# EasyEDA schematic TASHIMASU_MAINBOARD_2020-07-29_17-58-20.json
TITLE: Sheet_1; REV: 1.0; Date: 2019-01-28; Sheet: 1/1; Drawn By: ahmetakifkaya11; Company: Your Company
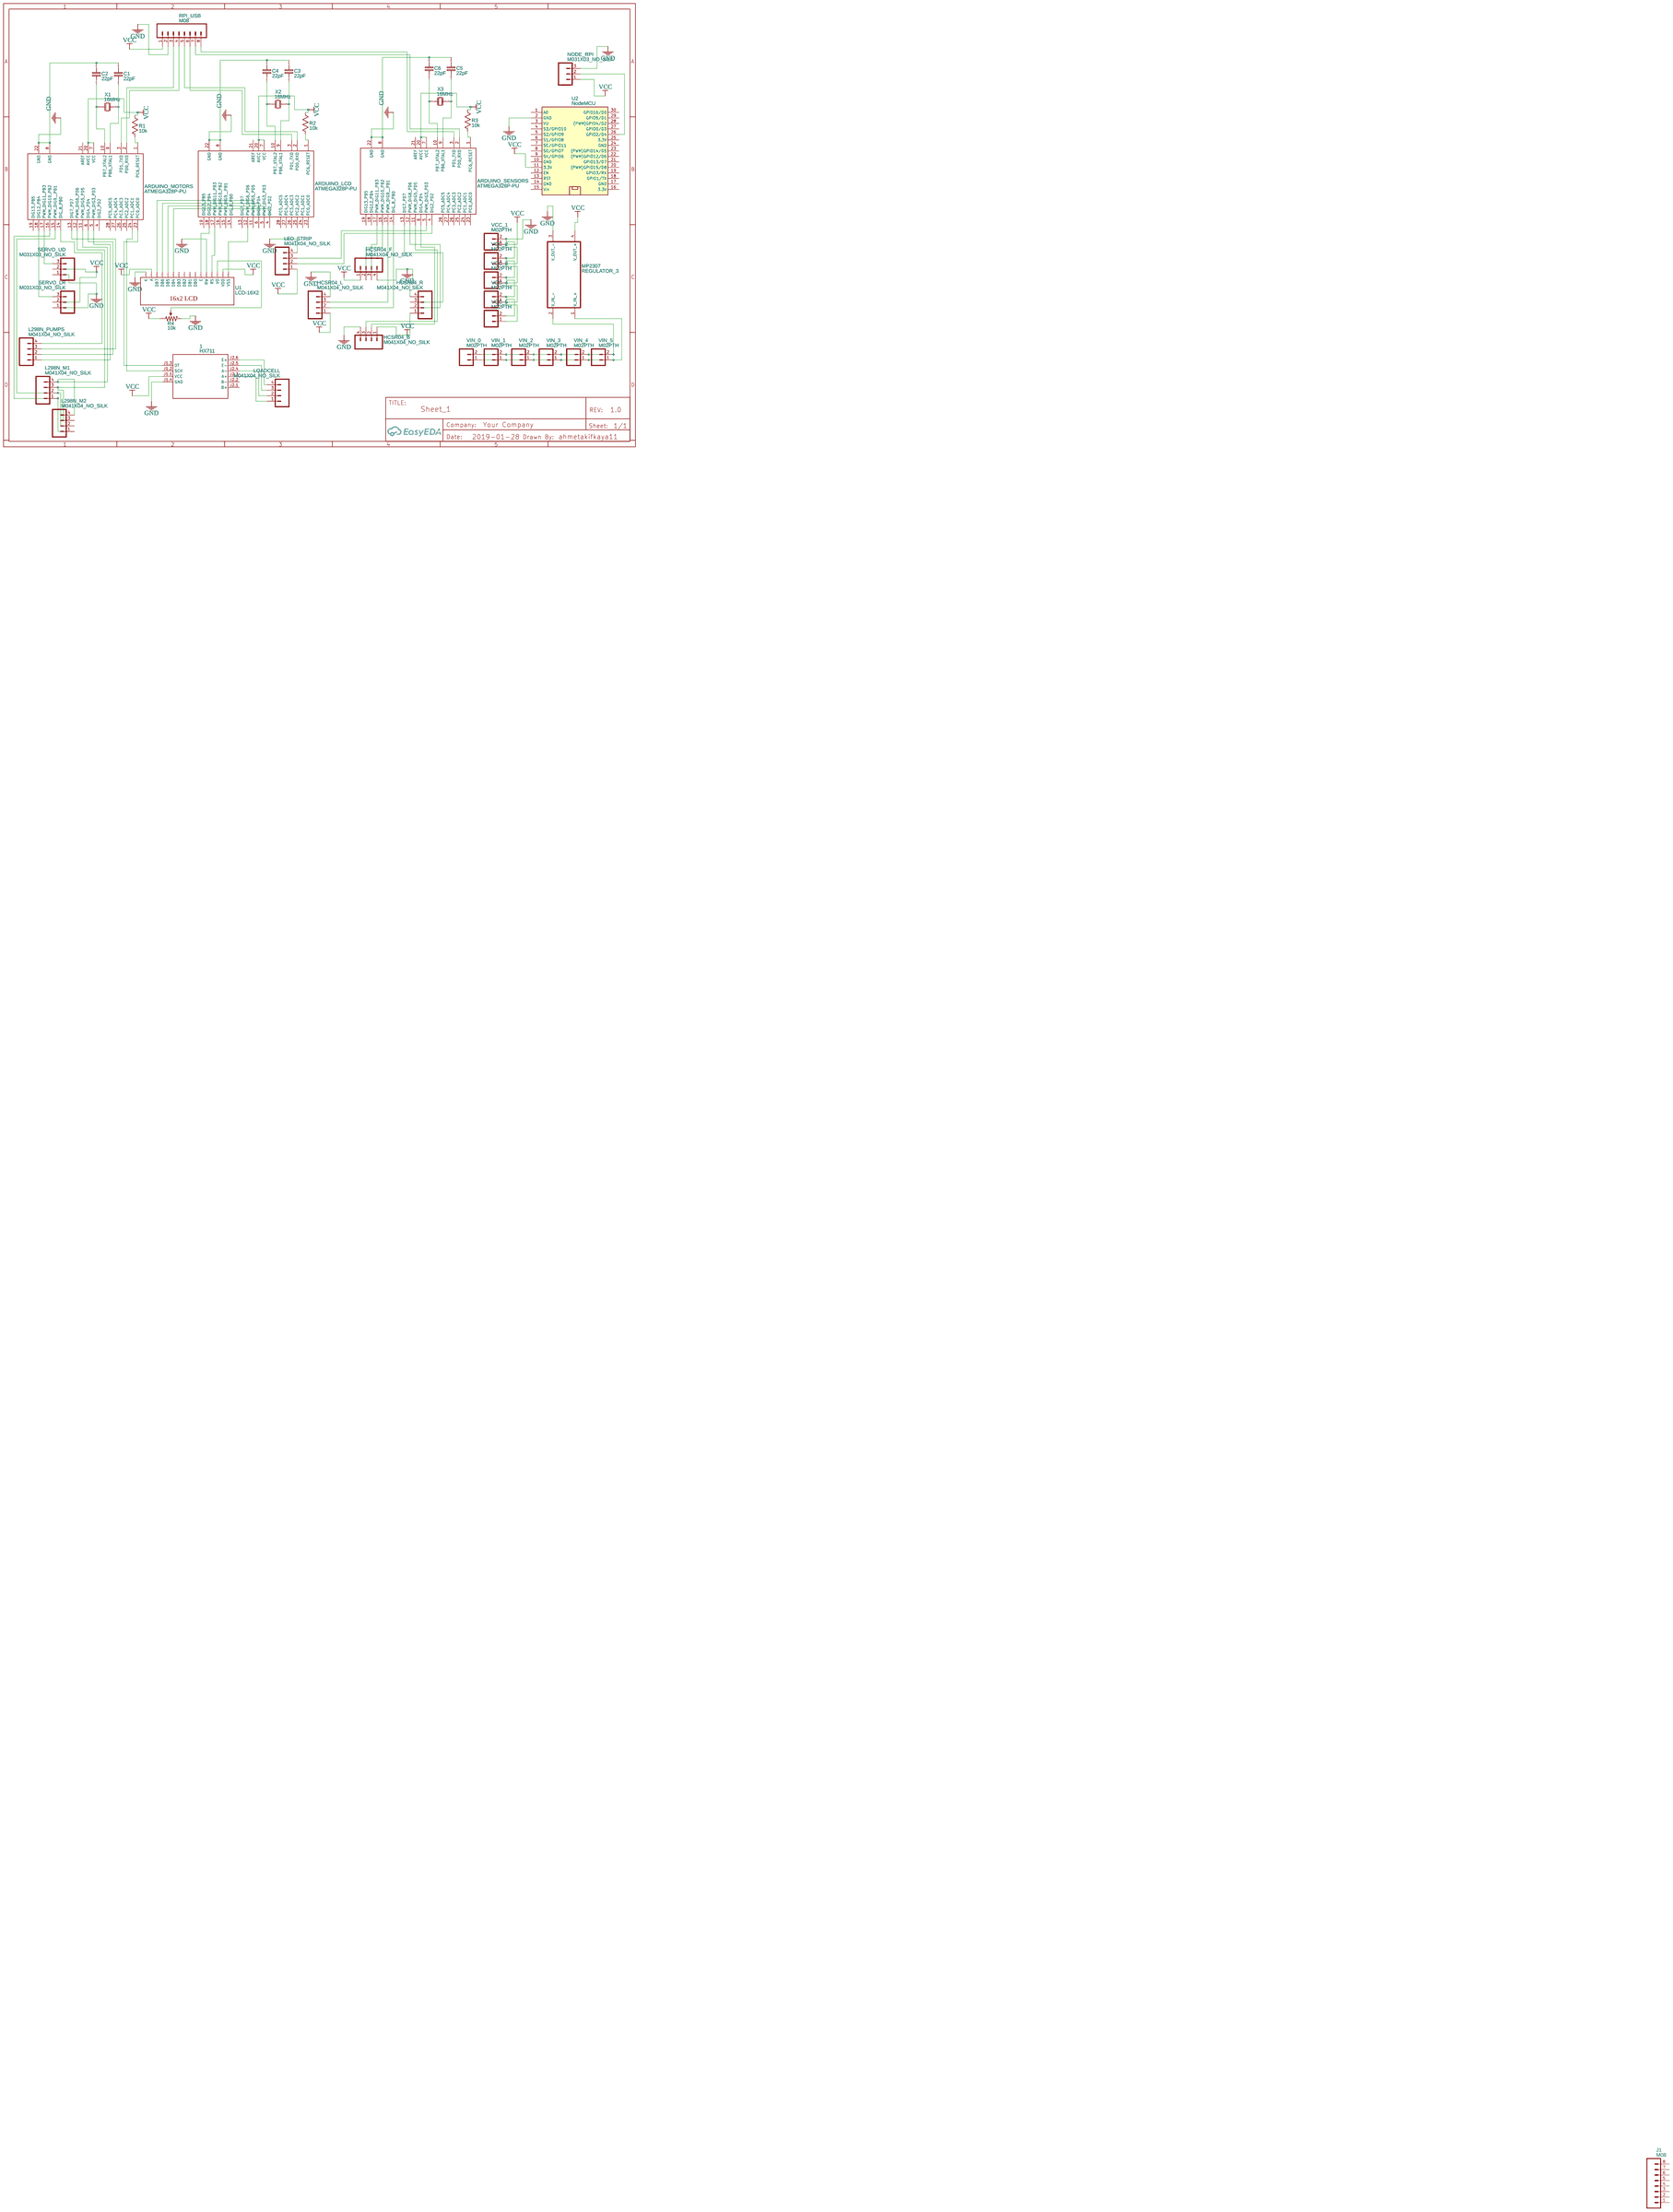
[diagram p0: schematic sheet]

## Parts
1  HX711  [HX711]
ARDUINO_LCD  ATMEGA328P-PU  [DIP-28_300MIL]
ARDUINO_MOTORS  ATMEGA328P-PU  [DIP-28_300MIL]
ARDUINO_SENSORS  ATMEGA328P-PU  [DIP-28_300MIL]
C1  22pF  [RAD-0.1]
C2  22pF  [RAD-0.1]
C3  22pF  [RAD-0.1]
C4  22pF  [RAD-0.1]
C5  22pF  [RAD-0.1]
C6  22pF  [RAD-0.1]
HCSR04_B  M041X04_NO_SILK  [1X04_NO_SILK]
HCSR04_F  M041X04_NO_SILK  [1X04_NO_SILK]
HCSR04_L  M041X04_NO_SILK  [1X04_NO_SILK]
HCSR04_R  M041X04_NO_SILK  [1X04_NO_SILK]
J1  M08  [1X08_ROUND]
L298N_M1  M041X04_NO_SILK  [1X04_NO_SILK]
L298N_M2  M041X04_NO_SILK  [1X04_NO_SILK]
L298N_PUMPS  M041X04_NO_SILK  [1X04_NO_SILK]
LED_STRIP  M041X04_NO_SILK  [1X04_NO_SILK]
LOADCELL  M041X04_NO_SILK  [1X04_NO_SILK]
NODE_RPI  M031X03_NO_SILK  [1X03_NO_SILK]
R1  10k  [AXIAL-0.3]
R2  10k  [AXIAL-0.3]
R3  10k  [AXIAL-0.3]
R4  10k  [RES-ADJ_3386P]
REGULATOR_3  MP2307  [MP2307-PCB SMALL]
RPI_USB  M08  [1X08_ROUND]
SERVO_LR  M031X03_NO_SILK  [1X03_NO_SILK]
SERVO_UD  M031X03_NO_SILK  [1X03_NO_SILK]
U1  LCD-16X2  [LCD-16X2]
U2  NodeMCU  [NODEMCU V3 LOLIN]
VCC_1  M02PTH  [1X02]
VCC_2  M02PTH  [1X02]
VCC_3  M02PTH  [1X02]
VCC_4  M02PTH  [1X02]
VCC_5  M02PTH  [1X02]
VIN_0  M02PTH  [1X02]
VIN_1  M02PTH  [1X02]
VIN_2  M02PTH  [1X02]
VIN_3  M02PTH  [1X02]
VIN_4  M02PTH  [1X02]
VIN_5  M02PTH  [1X02]
X1  16MHz  [OSC-49S-1]
X2  16MHz  [OSC-49S-1]
X3  16MHz  [OSC-49S-1]

## Library data of the parts
1 = -: Contributor: Krzysztof Handzlik; Manufacturer Part: ?
ARDUINO_LCD ARDUINO_MOTORS ARDUINO_SENSORS = -: sourceId: Oic6oiASL; Supplier: LCSC; Manufacturer: MICROCHIP; image: //image.lceda.cn/szlcsc/C33901.jpg; Contributor: LCSC; Supplier Part: C33901
C1-C6 = Cap_RAD-0.1_EU: Manufacturer Part: ?
HCSR04_B HCSR04_F HCSR04_L HCSR04_R L298N_M1 L298N_M2 L298N_PUMPS LED_STRIP LOADCELL = -: Header 4; Manufacturer Part: ?
J1 RPI_USB = -: Contributor: Gilmar Junior; Manufacturer Part: ?
NODE_RPI SERVO_LR SERVO_UD = -: Header 3; Manufacturer Part: ?
R1-R3 = Res_AXIAL-0.3(1/8W)_US: Manufacturer Part: ?
R4 = 3386P-1-101LF_US: Supplier: LCSC; Manufacturer: Bochen; Manufacturer Part: 3386P-1-101LF; Contributor: EasyEDA; Supplier Part: C125022
REGULATOR_3 = -: Manufacturer Part: ?
U1 = -: Contributor: SparkFun; Manufacturer Part: ?
U2 = -: Manufacturer Part: NodeMcu V3 LoLin; Contributor: Rudiawan Edwin, M.Si, M.PKim
VCC_1-VCC_5 VIN_0-VIN_5 = -: Header 2; Manufacturer Part: ?
X1-X3 = X49SD12MSD2SC: Supplier: LCSC; Manufacturer: YXC; Supplier Part: C16369

## Nets
GND: 1.J1.4(GND) ARDUINO_LCD.8(GND) ARDUINO_LCD.22(GND) ARDUINO_MOTORS.8(GND) ARDUINO_MOTORS.22(GND) ARDUINO_SENSORS.8(GND) ARDUINO_SENSORS.22(GND) C1.2 C2.2 C3.2 C4.2 C5.2 C6.2 HCSR04_B.4 HCSR04_F.4 HCSR04_L.4 HCSR04_R.4 LED_STRIP.4 NODE_RPI.3 R4.1 REGULATOR_3.3(V_OUT -) RPI_USB.2 SERVO_LR.1 SERVO_UD.1 U1.5(RW) U1.16(K) U2.2(GND) VCC_1.2 VCC_2.2 VCC_3.2 VCC_4.2 VCC_5.2
VCC: 1.J1.1(VCC) ARDUINO_LCD.7(VCC) ARDUINO_LCD.20(AVCC) ARDUINO_MOTORS.7(VCC) ARDUINO_MOTORS.20(AVCC) ARDUINO_SENSORS.7(VCC) ARDUINO_SENSORS.20(AVCC) HCSR04_B.1 HCSR04_F.1 HCSR04_L.1 HCSR04_R.1 LED_STRIP.1 NODE_RPI.1 R1.1 R2.1 R3.1 R4.3 REGULATOR_3.4(V_OUT +) RPI_USB.1 SERVO_LR.2 SERVO_UD.2 U1.2(VDD) U1.15(A) U2.11(3.3V) VCC_1.1 VCC_2.1 VCC_3.1 VCC_4.1 VCC_5.1
Net-(1-J1.2): 1.J1.2(SCK) ARDUINO_MOTORS.24(PC1 ADC1)
Net-(1-J1.3): 1.J1.3(DT) ARDUINO_MOTORS.23(PC0 ADC0)
Net-(1-J2.3): 1.J2.3(A+) LOADCELL.1
Net-(1-J2.4): 1.J2.4(A-) LOADCELL.2
Net-(1-J2.5): 1.J2.5(E-) LOADCELL.3
Net-(1-J2.6): 1.J2.6(E+) LOADCELL.4
Net-(ARDUINO_LCD-1): ARDUINO_LCD.1(PC6 RESET) R2.2
Net-(ARDUINO_LCD-2): ARDUINO_LCD.2(PD0 RXD) RPI_USB.5
Net-(ARDUINO_LCD-3): ARDUINO_LCD.3(PD1 TXD) RPI_USB.6
Net-(ARDUINO_LCD-4): ARDUINO_LCD.4(DIG2 PD2) U1.11(DB4)
Net-(ARDUINO_LCD-5): ARDUINO_LCD.5(PWM DIG3 PD3) U1.12(DB5)
Net-(ARDUINO_LCD-6): ARDUINO_LCD.6(DIG4 PD4) U1.13(DB6)
Net-(ARDUINO_LCD-9): ARDUINO_LCD.9(PB6 XTAL1) C3.1 X2.2(OSC2)
Net-(ARDUINO_LCD-10): ARDUINO_LCD.10(PB7 XTAL2) C4.1 X2.1(OSC1)
Net-(ARDUINO_LCD-11): ARDUINO_LCD.11(PWM DIG5 PD5) U1.14(DB7)
Net-(ARDUINO_LCD-12): ARDUINO_LCD.12(PWM DIG6 PD6) U1.1(VSS)
Net-(ARDUINO_LCD-17): ARDUINO_LCD.17(PWM DIG11 PB3) U1.4(RS)
Net-(ARDUINO_LCD-18): ARDUINO_LCD.18(DIG12 PB4) U1.6(E)
Net-(ARDUINO_MOTORS-1): ARDUINO_MOTORS.1(PC6 RESET) R1.2
Net-(ARDUINO_MOTORS-2): ARDUINO_MOTORS.2(PD0 RXD) RPI_USB.3
Net-(ARDUINO_MOTORS-3): ARDUINO_MOTORS.3(PD1 TXD) RPI_USB.4
Net-(ARDUINO_MOTORS-5): ARDUINO_MOTORS.5(PWM DIG3 PD3) L298N_PUMPS.1
Net-(ARDUINO_MOTORS-6): ARDUINO_MOTORS.6(DIG4 PD4) L298N_PUMPS.2
Net-(ARDUINO_MOTORS-9): ARDUINO_MOTORS.9(PB6 XTAL1) C1.1 X1.2(OSC2)
Net-(ARDUINO_MOTORS-10): ARDUINO_MOTORS.10(PB7 XTAL2) C2.1 X1.1(OSC1)
Net-(ARDUINO_MOTORS-11): ARDUINO_MOTORS.11(PWM DIG5 PD5) L298N_M1.4 L298N_M2.4
Net-(ARDUINO_MOTORS-12): ARDUINO_MOTORS.12(PWM DIG6 PD6) L298N_M1.3 L298N_M2.3
Net-(ARDUINO_MOTORS-13): ARDUINO_MOTORS.13(DIG7 PD7) L298N_PUMPS.3
Net-(ARDUINO_MOTORS-14): ARDUINO_MOTORS.14(DIG 8 PB0) L298N_PUMPS.4
Net-(ARDUINO_MOTORS-15): ARDUINO_MOTORS.15(PWM DIG9  PB1) L298N_M1.2 L298N_M2.2
Net-(ARDUINO_MOTORS-16): ARDUINO_MOTORS.16(PWM DIG10 PB2) L298N_M1.1 L298N_M2.1
Net-(ARDUINO_MOTORS-17): ARDUINO_MOTORS.17(PWM DIG11 PB3) SERVO_UD.3
Net-(ARDUINO_MOTORS-18): ARDUINO_MOTORS.18(DIG12 PB4) SERVO_LR.3
Net-(ARDUINO_SENSORS-1): ARDUINO_SENSORS.1(PC6 RESET) R3.2
Net-(ARDUINO_SENSORS-2): ARDUINO_SENSORS.2(PD0 RXD) RPI_USB.7
Net-(ARDUINO_SENSORS-3): ARDUINO_SENSORS.3(PD1 TXD) RPI_USB.8
Net-(ARDUINO_SENSORS-4): ARDUINO_SENSORS.4(DIG2 PD2) LED_STRIP.2
Net-(ARDUINO_SENSORS-5): ARDUINO_SENSORS.5(PWM DIG3 PD3) LED_STRIP.3
Net-(ARDUINO_SENSORS-6): ARDUINO_SENSORS.6(DIG4 PD4) HCSR04_B.2
Net-(ARDUINO_SENSORS-9): ARDUINO_SENSORS.9(PB6 XTAL1) C5.1 X3.2(OSC2)
Net-(ARDUINO_SENSORS-10): ARDUINO_SENSORS.10(PB7 XTAL2) C6.1 X3.1(OSC1)
Net-(ARDUINO_SENSORS-11): ARDUINO_SENSORS.11(PWM DIG5 PD5) HCSR04_B.3
Net-(ARDUINO_SENSORS-12): ARDUINO_SENSORS.12(PWM DIG6 PD6) HCSR04_R.2
Net-(ARDUINO_SENSORS-13): ARDUINO_SENSORS.13(DIG7 PD7) HCSR04_R.3
Net-(ARDUINO_SENSORS-14): ARDUINO_SENSORS.14(DIG 8 PB0) HCSR04_L.2
Net-(ARDUINO_SENSORS-15): ARDUINO_SENSORS.15(PWM DIG9  PB1) HCSR04_L.3
Net-(ARDUINO_SENSORS-16): ARDUINO_SENSORS.16(PWM DIG10 PB2) HCSR04_F.2
Net-(ARDUINO_SENSORS-17): ARDUINO_SENSORS.17(PWM DIG11 PB3) HCSR04_F.3
Net-(NODE_RPI-2): NODE_RPI.2 U2.26(GPIO2/D4)
Net-(R4-2): R4.2 U1.3(VO)
Net-(REGULATOR_3-1): REGULATOR_3.1(V_IN +) VIN_0.1 VIN_1.1 VIN_2.1 VIN_3.1 VIN_4.1 VIN_5.1
Net-(REGULATOR_3-2): REGULATOR_3.2(V_IN -) VIN_0.2 VIN_1.2 VIN_2.2 VIN_3.2 VIN_4.2 VIN_5.2

Not connected (* = marked no-connect by the designer): 1 J2.1(B+) J2.2(B-); ARDUINO_LCD 13(DIG7 PD7) 14(DIG 8 PB0) 15(PWM DIG9  PB1) 16(PWM DIG10 PB2) 19(DIG13 PB5) 21(AREF) 23(PC0 ADC0) 24(PC1 ADC1) 25(PC2 ADC2) 26(PC3 ADC3) 27(PC4 ADC4) 28(PC5 ADC5); ARDUINO_MOTORS 4(DIG2 PD2) 19(DIG13 PB5) 21(AREF) 25(PC2 ADC2) 26(PC3 ADC3) 27(PC4 ADC4) 28(PC5 ADC5); ARDUINO_SENSORS 18(DIG12 PB4) 19(DIG13 PB5) 21(AREF) 23(PC0 ADC0) 24(PC1 ADC1) 25(PC2 ADC2) 26(PC3 ADC3) 27(PC4 ADC4) 28(PC5 ADC5); J1 1 2 3 4 5 6 7 8; U1 7(DB0) 8(DB1) 9(DB2) 10(DB3); U2 1(A0) 3(VU) 4(S3/GPIO10) 5(S2/GPIO9) 6(S1/GPIO8) 7(SC/GPIO11) 8(S0/GPIO7) 9(SK/GPIO6) 10(GND) 12(EN) 13(RST) 14(GND) 15(Vin) 16(3.3V) 17(GND) 18(GPIO1/TX) 19(GPIO3/RX) 20((PWM)GPIO15/D8) 21(GPIO13/D7) 22((PWM)GPIO12/D6) 23((PWM)GPIO14/D5) 24(GND) 25(3.3V) 27(GPIO0/D3) 28((PWM)GPIO4/D2) 29(GPIO5/D1) 30(GPIO16/D0)
